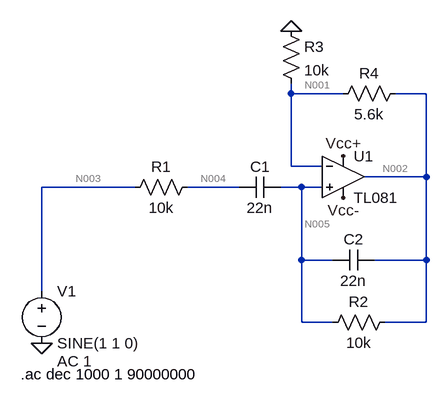
[diagram p0: schematic Draft5.asc]
* Draft5.asc
V1 N003 0 SINE(1 1 0) AC 1
R1 N004 N003 10k
C1 N005 N004 22n
R2 N002 N005 10k
C2 N002 N005 22n
R3 0 N001 10k
R4 N002 N001 5.6k
* U1: TL081 (symbol OpAmps\TL081 not available, pins judged from their places): In+=N005 In-=N001 V+=Vcc+ V-=Vcc- OUT=N002
.ac dec 1000 1 90000000
.backanno
.end

* Results of the author's LTspice run, read from the files saved beside the schematic
* Operating Point, zero values left out:
*   V(n004) = 1 V
*   V(n002) = -3.557 mV
*   V(n001) = -2.281 mV
*   V(vcc-) = -1.472 V
*   V(n003) = 1 V
*   V(n005) = -3.558 mV
*   V(vcc+) = 1.464 V
*   I(R3) = 228.1 nA
*   I(R2) = 31.52 pA
*   I(R4) = -228 nA
*   Ix(u1:1) = 31.52 pA
*   Ix(u1:2) = 31.52 pA
*   Ix(u1:5) = 228 nA
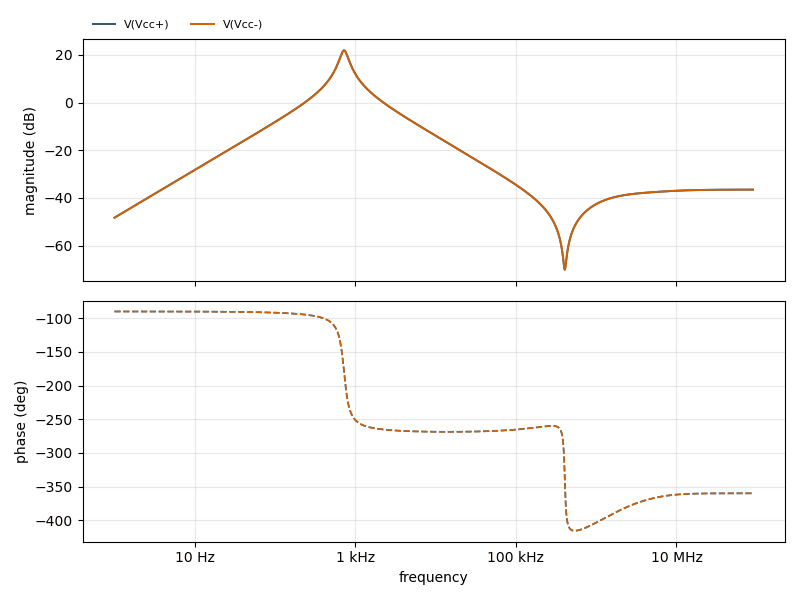
[diagram p1: AC Analysis of Draft5.asc, plotted from the saved traces]
* AC Analysis, 1 run:
*   V(Vcc+): -48.32 dB at 1 Hz, -36.54 dB at 90 MHz, peak 21.90 dB at 724.4 Hz, 3 dB below the peak at 647.6 Hz and 809.4 Hz
*   V(Vcc-): -48.32 dB at 1 Hz, -36.54 dB at 90 MHz, peak 21.90 dB at 724.4 Hz, 3 dB below the peak at 647.6 Hz and 809.4 Hz